# Altium project PCB_Project_DAC7731.PrjPCB
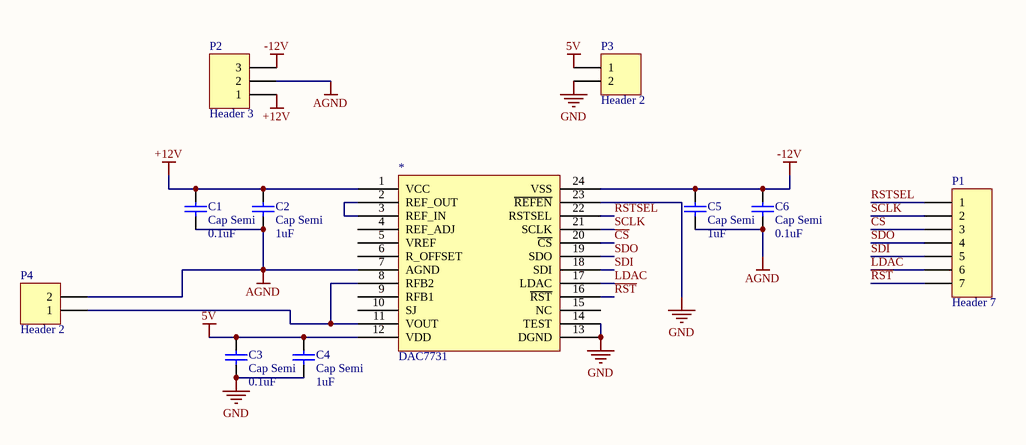
[diagram p0: DAC7731.SchDoc]
1 sheet, 11 parts. Net scope: global (net labels, ports and power ports of the same name join across sheets).
Board file: PCB1.PcbDoc

## Sheet DAC7731.SchDoc
size A

### Parts
*  DAC7731  [TSSOP24]
C1  Cap Semi  value 0.1uF  [C1206]
C2  Cap Semi  value 1uF  [C1206]
C3  Cap Semi  value 0.1uF  [C1206]
C4  Cap Semi  value 1uF  [C1206]
C5  Cap Semi  value 1uF  [C1206]
C6  Cap Semi  value 0.1uF  [C1206]
P1  Header 7  [HDR1X7]
P2  Header 3  [HDR1X3]
P3  Header 2  [HDR1X2]
P4  Header 2  [HDR1X2]

### Nets
5V: *.12(VDD) C3.2 C4.2 P3.1
+12V: *.1(VCC) C1.2 C2.2 P2.1
-12V: *.24(VSS) C5.2 C6.2 P2.3
AGND: *.7(AGND) C1.1 C2.1 C5.1 C6.1 P2.2 P4.2
GND: *.13(DGND) *.14(TEST) *.23(~{REFEN}) C3.1 C4.1 P3.2
~{CS}: *.20(~{CS}) P1.3
~{RST}: *.16(~{RST}) P1.7
LDAC: *.17(LDAC) P1.6
RSTSEL: *.22(RSTSEL) P1.1
SCLK: *.21(SCLK) P1.2
SDI: *.18(SDI) P1.5
SDO: *.19(SDO) P1.4
Net*_2: *.2(REF_OUT) *.3(REF_IN)
Net*_8: *.8(RFB2) *.11(VOUT) P4.1

Not connected (* = marked no-connect by the designer): * 4(REF_ADJ) 5(VREF) 6(R_OFFSET) 9(RFB1) 10(SJ) 15(NC)

### Library data of the parts
C1-C6 = Cap Semi: Capacitor (Semiconductor SIM Model); Published: 8-Jun-2000; LatestRevisionDate: 29-May-2009; LatestRevisionNote: IPC-7351 Footprint Added.; PackageReference: C1206; Publisher: Altium Limited; PackageDescription: Chip Capacitor
P1 = Header 7: Header, 7-Pin; LatestRevisionDate: 17-Jul-2002; LatestRevisionNote: Re-released for DXP Platform.; Publisher: Altium Limited
P2 = Header 3: Header, 3-Pin; LatestRevisionDate: 17-Jul-2002; LatestRevisionNote: Re-released for DXP Platform.; Publisher: Altium Limited
P3 P4 = Header 2: Header, 2-Pin; LatestRevisionDate: 17-Jul-2002; LatestRevisionNote: Re-released for DXP Platform.; Publisher: Altium Limited